# Altium schematic sheet P11 Hi3531A(SYSTEM)&RES.SchDoc
size 420 x 297 mm
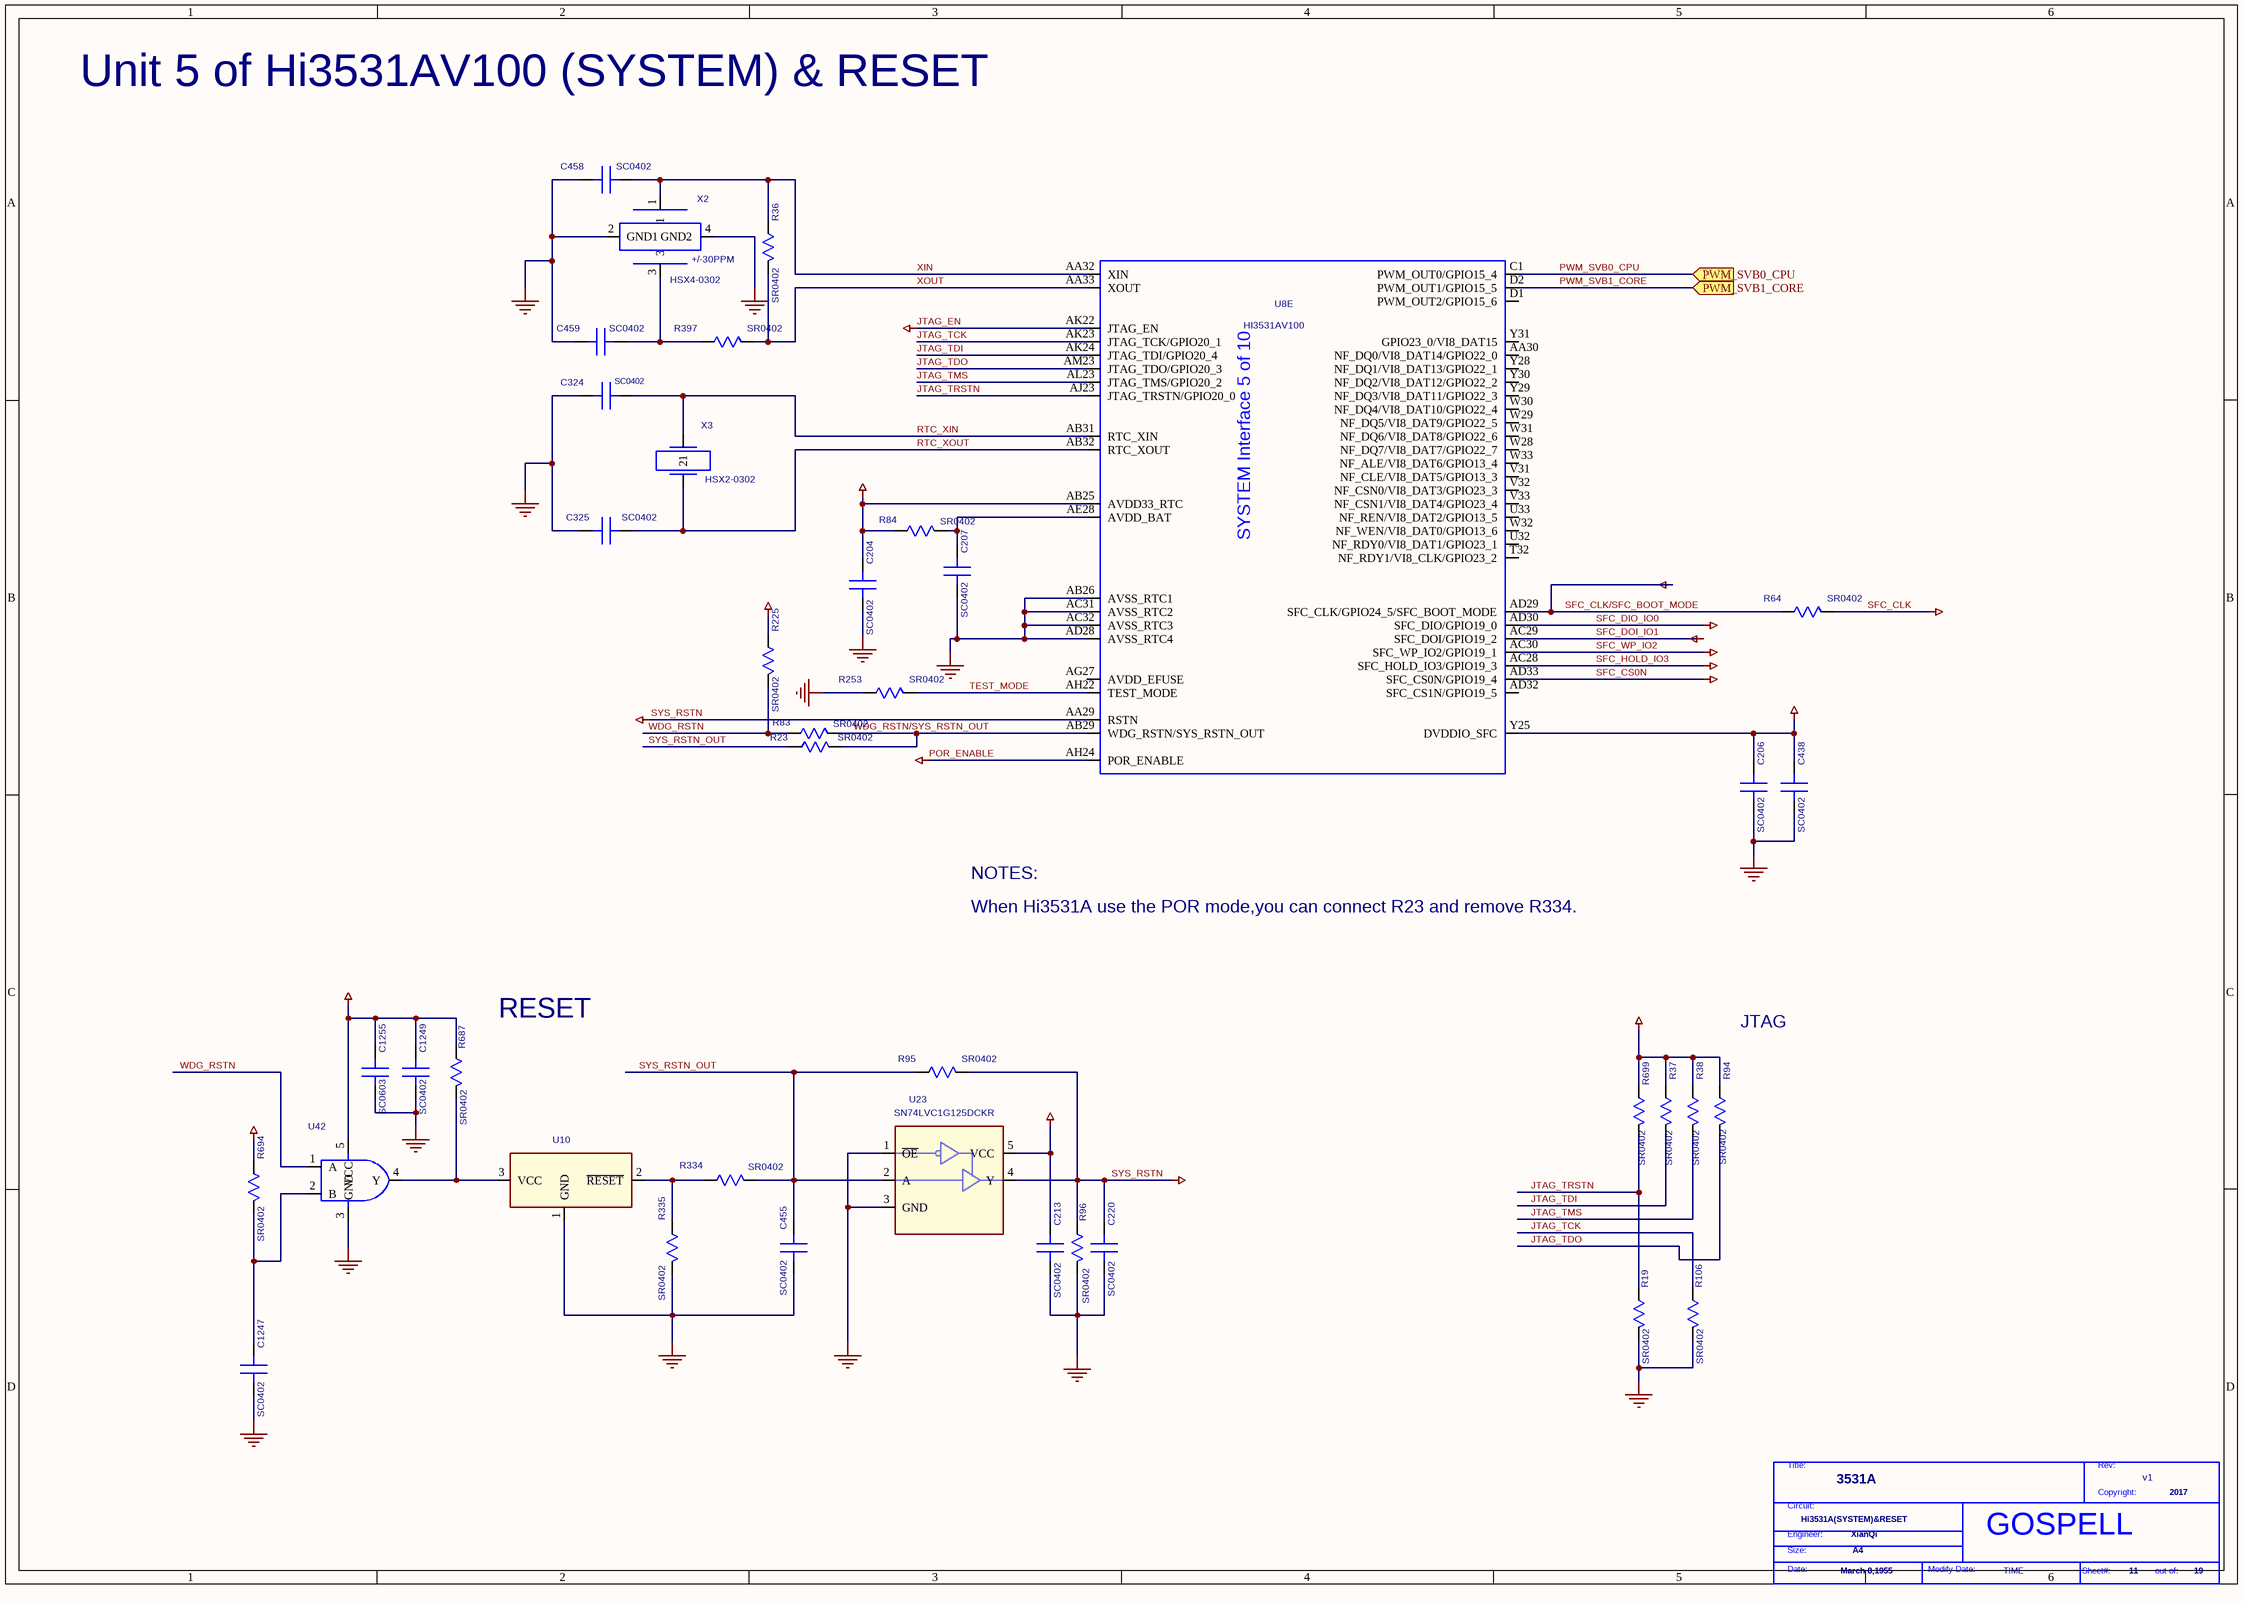
[diagram p0: P11 Hi3531A(SYSTEM)&RES.SchDoc]

## Parts
*  Page Modify Date: TIME  Engineer: XianQi  Copyright: 2017  Title: 3531A  RevCode: v1  Page Size: A4  Page Create Date: March 8,1955  Page Number: 11  Page Count: 19  Doc: Hi3531A(SYSTEM)&RESET  (hidden comment: GOSPELL)  (graphical)
C204  SC0402  [SC0402]
C206  SC0402  [SC0402]
C207  SC0402  [SC0402]
C213  SC0402  [SC0402]
C220  SC0402  [SC0402]
C324  SC0402  [SC0402]
C325  SC0402  [SC0402]
C438  SC0402  [SC0402]
C455  SC0402  [SC0402]
C458  SC0402  [SC0402]
C459  SC0402  [SC0402]
C1247  SC0402  [SC0402]
C1249  SC0402  [SC0402]
C1255  SC0603  [SC0603]
R19  SR0402  [SR0402]
R23  SR0402  [SR0402]
R36  SR0402  [SR0402]
R37  SR0402  [SR0402]
R38  SR0402  [SR0402]
R64  SR0402  [SR0402]
R83  SR0402  [SR0402]
R84  SR0402  [SR0402]
R94  SR0402  [SR0402]
R95  SR0402  [SR0402]
R96  SR0402  [SR0402]
R106  SR0402  [SR0402]
R225  SR0402  [SR0402]
R253  SR0402  [SR0402]
R334  SR0402  [SR0402]
R335  SR0402  [SR0402]
R397  SR0402  [SR0402]
R687  SR0402  [SR0402]
R694  SR0402  [SR0402]
R699  SR0402  [SR0402]
U8  DEVICE: HI3531AV100  [BGA805-32-3333]  (hidden comment: BGA805-32-3333)  (part E of 10)
U10  SOT23B  [SOT23B]  (value not drawn)
U23  DEVICE: SN74LVC1G125DCKR  [HSOT-SC70-DCK]  (hidden comment: HSOT-SC70-DCK)
U42  SOT23-5C  [SOT23-5C]  (value not drawn)
X2  HSX4-0302  [HSX4-0302]
X3  HSX2-0302  [HSX2-0302]

## Ports
PWM_SVB0_CPU (in), PWM_SVB1_CORE (in)

## Nets
3V3: C204.1(A) C206.1(A) C213.1(A) C438.1(A) C1249.1(A) C1255.1(A) R37.1(A) R38.1(A) R84.1(A) R94.1(A) R225.1(A) R687.1(A) R694.1(A) R699.1(A) U8.AB25(AVDD33_RTC) U8.Y25(DVDDIO_SFC) U23.5(VCC) U42.5(VCC)
GND: C204.2(B) C206.2(B) C207.2(B) C213.2(B) C220.2(B) C324.1(A) C325.1(A) C438.2(B) C455.2(B) C458.1(A) C459.1(A) C1247.2(B) C1249.2(B) C1255.2(B) R19.2(B) R96.2(B) R106.2(B) R253.1(A) R335.2(B) U8.AB26(AVSS_RTC1) U8.AC31(AVSS_RTC2) U8.AC32(AVSS_RTC3) U8.AD28(AVSS_RTC4) U10.1(GND) U23.1(~{OE}) U23.3(GND) U42.3(GND) X2.2(GND1) X2.4(GND2)
JTAG_EN: U8.AK22(JTAG_EN)
POR_ENABLE: U8.AH24(POR_ENABLE)
SFC_CLK: R64.2(B)
SFC_CLK/SFC_BOOT_MODE: R64.1(A) U8.AD29(SFC_CLK/GPIO24_5/SFC_BOOT_MODE)
SFC_CS0N: U8.AD33(SFC_CS0N/GPIO19_4)
SFC_DIO_IO0: U8.AD30(SFC_DIO/GPIO19_0)
SFC_DOI_IO1: U8.AC29(SFC_DOI/GPIO19_2)
SFC_HOLD_IO3: U8.AC28(SFC_HOLD_IO3/GPIO19_3)
SFC_WP_IO2: U8.AC30(SFC_WP_IO2/GPIO19_1)
SYS_RSTN: C220.1(A) R95.2(B) R96.1(A) U8.AA29(RSTN) U23.4(Y)
JTAG_TCK: R106.1(A) U8.AK23(JTAG_TCK/GPIO20_1)
JTAG_TDI: R37.2(B) U8.AK24(JTAG_TDI/GPIO20_4)
JTAG_TDO: R94.2(B) U8.AM23(JTAG_TDO/GPIO20_3)
JTAG_TMS: R38.2(B) U8.AL23(JTAG_TMS/GPIO20_2)
JTAG_TRSTN: R19.1(A) R699.2(B) U8.AJ23(JTAG_TRSTN/GPIO20_0)
PWM_SVB0_CPU: U8.C1(PWM_OUT0/GPIO15_4) ; port PWM_SVB0_CPU
PWM_SVB1_CORE: U8.D2(PWM_OUT1/GPIO15_5) ; port PWM_SVB1_CORE
RTC_XIN: C324.2(B) U8.AB31(RTC_XIN) X3.1
RTC_XOUT: C325.2(B) U8.AB32(RTC_XOUT) X3.2
SYS_RSTN_OUT: C455.1(A) R23.1(A) R95.1(A) R334.2(B) U23.2(A)
TEST_MODE: R253.2(B) U8.AH22(TEST_MODE)
WDG_RSTN: R83.1(A) R225.2(B) U42.1(A)
WDG_RSTN/SYS_RSTN_OUT: R23.2(B) R83.2(B) U8.AB29(WDG_RSTN/SYS_RSTN_OUT)
XIN: C458.2(B) R36.1(A) U8.AA32(XIN) X2.1
XOUT: R36.2(B) R397.2(B) U8.AA33(XOUT)
NetC207_1: C207.1(A) R84.2(B) U8.AE28(AVDD_BAT)
NetC459_2: C459.2(B) R397.1(A) X2.3
NetC1247_1: C1247.1(A) R694.2(B) U42.2(B)
NetR334_1: R334.1(A) R335.1(A) U10.2(~{RESET})
NetR687_2: R687.2(B) U10.3(VCC) U42.4(Y)

Not connected (* = marked no-connect by the designer): U8 AA30(NF_DQ0/VI8_DAT14/GPIO22_0) AD32(SFC_CS1N/GPIO19_5) AG27(AVDD_EFUSE) D1(PWM_OUT2/GPIO15_6) T32(NF_RDY1/VI8_CLK/GPIO23_2) U32(NF_RDY0/VI8_DAT1/GPIO23_1) U33(NF_REN/VI8_DAT2/GPIO13_5) V31(NF_CLE/VI8_DAT5/GPIO13_3) V32(NF_CSN0/VI8_DAT3/GPIO23_3) V33(NF_CSN1/VI8_DAT4/GPIO23_4) W28(NF_DQ7/VI8_DAT7/GPIO22_7) W29(NF_DQ5/VI8_DAT9/GPIO22_5) W30(NF_DQ4/VI8_DAT10/GPIO22_4) W31(NF_DQ6/VI8_DAT8/GPIO22_6) W32(NF_WEN/VI8_DAT0/GPIO13_6) W33(NF_ALE/VI8_DAT6/GPIO13_4) Y28(NF_DQ1/VI8_DAT13/GPIO22_1) Y29(NF_DQ3/VI8_DAT11/GPIO22_3) Y30(NF_DQ2/VI8_DAT12/GPIO22_2) Y31(GPIO23_0/VI8_DAT15)

## Notes on the sheet
- Unit 5 of Hi3531AV100 (SYSTEM) & RESET
- (near X2) +/-30PPM
- When Hi3531A use the POR mode,you can connect R23 and remove R334.
- NOTES:
- (near R687) RESET
- JTAG
- (in symbol GOSPELL) Title:; Rev:; Copyright:; Circuit:; Engineer:; Size:; Date:; Modify Date:; Sheet#:; out of:
- (in symbol HI3531AV100_M2_17, part E) SYSTEM Interface 5 of 10

## Library data of the parts
C204 C206 C207 C1247 = C_0_Dup2: PARTS: 1; PINSWAP: (A,B); LEVEL: STD; DEVICE: RMEMK105BJ104KV_FR; OriginalSymbolOrigin: (0,30); %208%%161%%192%%224%%195%%251%%179%%198%: SMD陶瓷电容; COMPONENT_HIGH_MAX: 0.55MM; %182%%238%%182%%168%%185%%164%%215%%247%%181%%231%%209%%185%(V): 16; %195%%232%%202%%246%: SMD陶瓷电容-16V-100NF-+/-10%-X7R-0402-BT; CODE: 8070614; PKG_TYPE: SC0402
C213 = C_0_Dup2: PARTS: 1; PINSWAP: (A,B); LEVEL: STD; DEVICE: RMEMK105BJ104KV_FR; OriginalSymbolOrigin: (0,30); CODE: 8070614; %195%%232%%202%%246%: SMD陶瓷电容-16V-100NF-+/-10%-X7R-0402-BT; %182%%238%%182%%168%%185%%164%%215%%247%%181%%231%%209%%185%(V): 16; COMPONENT_HIGH_MAX: 0.55MM; %208%%161%%192%%224%%195%%251%%179%%198%: SMD陶瓷电容; PKG_TYPE: SC0402
C220 C455 = C_0_Dup2: PARTS: 1; PINSWAP: (A,B); LEVEL: STD; DEVICE: 04025C102KAT2A; OriginalSymbolOrigin: (0,30); CODE: 8070531; %195%%232%%202%%246%: SMD陶瓷电容-50V-1NF-+/-10%-X7R-0402-BT; %182%%238%%182%%168%%185%%164%%215%%247%%181%%231%%209%%185%(V): 50; COMPONENT_HIGH_MAX: 0.56MM; %208%%161%%192%%224%%195%%251%%179%%198%: SMD陶瓷电容; PKG_TYPE: SC0402
C324 C325 = C_0_Dup2: PARTS: 1; PINSWAP: (A,B); LEVEL: STD; DEVICE: RMUMK105CG220JV_F; OriginalSymbolOrigin: (0,30); %208%%161%%192%%224%%195%%251%%179%%198%: SMD陶瓷电容; COMPONENT_HIGH_MAX: 0.55MM; %182%%238%%182%%168%%185%%164%%215%%247%%181%%231%%209%%185%(V): 50; %195%%232%%202%%246%: SMD陶瓷电容-50V-0.022NF-+/-5%-NP0-0402-BT; CODE: 8070545; PKG_TYPE: SC0402
C438 = C_0_Dup2: PARTS: 1; PINSWAP: (A,B); LEVEL: STD; DEVICE: C1005X5R0J475MTJ00F; OriginalSymbolOrigin: (0,30); %208%%161%%192%%224%%195%%251%%179%%198%: SMD陶瓷电容; COMPONENT_HIGH_MAX: 0.65MM; %182%%238%%182%%168%%185%%164%%215%%247%%181%%231%%209%%185%(V): 6.3; %195%%232%%202%%246%: SMD陶瓷电容-6.3V-4700NF-+/-20%-X5R-0402; CODE: 8071610; PKG_TYPE: SC0402
C458 C459 = C_0_Dup2: PARTS: 1; PINSWAP: (A,B); LEVEL: STD; DEVICE: C0402C150J5GAC_7867; OriginalSymbolOrigin: (0,30); CODE: 08070580; %195%%232%%202%%246%: SMD陶瓷电容-50V-0.015NF-+/-5%-NP0-0402; %182%%238%%182%%168%%185%%164%%215%%247%%181%%231%%209%%185%(V): 50; COMPONENT_HIGH_MAX: 0.55MM; %208%%161%%192%%224%%195%%251%%179%%198%: SMD陶瓷电容; PKG_TYPE: SC0402
C1249 = C_0_Dup2: PARTS: 1; PINSWAP: (A,B); LEVEL: STD; DEVICE: C0402C104K8PAC_7867; OriginalSymbolOrigin: (0,30); CODE: 8070561; %195%%232%%202%%246%: SMD陶瓷电容-10V-100NF-+/-10%-X5R-0402; %182%%238%%182%%168%%185%%164%%215%%247%%181%%231%%209%%185%(V): 10; COMPONENT_HIGH_MAX: 0.55MM; %208%%161%%192%%224%%195%%251%%179%%198%: SMD陶瓷电容; ALT_SYMBOLS: (T:SC0402;B:SC0402,SC0402-BGA,SC0402-BGA-A); TECHNIC: 回流回流; PKG_TYPE: SC0402
C1255 = C_0_Dup2: PARTS: 1; PINSWAP: (A,B); LEVEL: STD; DEVICE: C1608X5R0J106MT0A0E_A; OriginalSymbolOrigin: (0,30); %208%%161%%192%%224%%195%%251%%179%%198%: SMD陶瓷电容; COMPONENT_HIGH_MAX: 0.9MM; %182%%238%%182%%168%%185%%164%%215%%247%%181%%231%%209%%185%(V): 6.3; %195%%232%%202%%246%: SMD陶瓷电容-6.3V-10000NF-+/-20%-X5R-0603; CODE: 8070821; PKG_TYPE: SC0603
R19 = R_2: PARTS: 1; OriginalSymbolOrigin: (10,20); PINSWAP: (A,B); DEVICE: RK73H1ETTP1002F; LEVEL: STD; %208%%161%%192%%224%%195%%251%%179%%198%: 片式厚膜电阻器; COMPONENT_HIGH_MAX: 0.4MM; %215%%232%%214%%181%%212%%202%%208%%237%%198%%171%%178%%238%: +/-1%; %182%%238%%182%%168%%185%%166%%194%%202%(W): 0.06; %195%%232%%202%%246%: 片式厚膜电阻器-0.0625W-10000OHM-+/-1%-0402-BT; CODE: 7090867; PKG_TYPE: SR0402
R23 R95 = R_1: PARTS: 1; LEVEL: STD; DEVICE: RC0402JR_070R; PINSWAP: (A,B); OriginalSymbolOrigin: (10,20); CODE: 7090800; %195%%232%%202%%246%: 片式厚膜电阻器-0.0625W-0OHM-< 50MOHM-0402-1A-BT; %182%%238%%182%%168%%185%%166%%194%%202%(W): 0.06; %215%%232%%214%%181%%212%%202%%208%%237%%198%%171%%178%%238%: < 50MOHM; COMPONENT_HIGH_MAX: 0.4MM; %208%%161%%192%%224%%195%%251%%179%%198%: 片式厚膜电阻器; PKG_TYPE: SR0402
R36 = R_1: PARTS: 1; LEVEL: STD; DEVICE: RK73H1ETTP1004F; PINSWAP: (A,B); OriginalSymbolOrigin: (10,20); %208%%161%%192%%224%%195%%251%%179%%198%: 片式厚膜电阻器; COMPONENT_HIGH_MAX: 0.4MM; %215%%232%%214%%181%%212%%202%%208%%237%%198%%171%%178%%238%: ±1%; %182%%238%%182%%168%%185%%166%%194%%202%(W): 0.06; %195%%232%%202%%246%: 片式厚膜电阻器-0.0625W-1000000OHM-±1%-0402; CODE: 7090857; PKG_TYPE: SR0402
R37 = R_2: PARTS: 1; OriginalSymbolOrigin: (10,20); PINSWAP: (A,B); DEVICE: RK73B1ELTP472J; LEVEL: STD; %208%%161%%192%%224%%195%%251%%179%%198%: 片式厚膜电阻器; COMPONENT_HIGH_MAX: 0.4MM; %215%%232%%214%%181%%212%%202%%208%%237%%198%%171%%178%%238%: +/-5%; %182%%238%%182%%168%%185%%166%%194%%202%(W): 0.06; %195%%232%%202%%246%: 片式厚膜电阻器-0.0625W-4700OHM-+/-5%-0402-BT; CODE: 7090793; PKG_TYPE: SR0402
R38 R94 R699 = R_2: PARTS: 1; OriginalSymbolOrigin: (10,20); PINSWAP: (A,B); DEVICE: RK73B1ELTP472J; LEVEL: STD; CODE: 7090793; %195%%232%%202%%246%: 片式厚膜电阻器-0.0625W-4700OHM-+/-5%-0402-BT; %182%%238%%182%%168%%185%%166%%194%%202%(W): 0.06; %215%%232%%214%%181%%212%%202%%208%%237%%198%%171%%178%%238%: +/-5%; COMPONENT_HIGH_MAX: 0.4MM; %208%%161%%192%%224%%195%%251%%179%%198%: 片式厚膜电阻器; PKG_TYPE: SR0402
R64 = R_1: PARTS: 1; LEVEL: STD; DEVICE: RC0402FR_0733RL; PINSWAP: (A,B); OriginalSymbolOrigin: (10,20); CODE: 7090836; %195%%232%%202%%246%: 片式厚膜电阻器-0.0625W-33OHM-+/-1%-0402; %182%%238%%182%%168%%185%%166%%194%%202%(W): 0.06; %215%%232%%214%%181%%212%%202%%208%%237%%198%%171%%178%%238%: +/-1%; COMPONENT_HIGH_MAX: 0.4MM; %208%%161%%192%%224%%195%%251%%179%%198%: 片式厚膜电阻器; PKG_TYPE: SR0402
R83 R84 = R_1: PARTS: 1; LEVEL: STD; DEVICE: RC0402JR_070R; PINSWAP: (A,B); OriginalSymbolOrigin: (10,20); %208%%161%%192%%224%%195%%251%%179%%198%: 片式厚膜电阻器; COMPONENT_HIGH_MAX: 0.4MM; %215%%232%%214%%181%%212%%202%%208%%237%%198%%171%%178%%238%: < 50MOHM; %182%%238%%182%%168%%185%%166%%194%%202%(W): 0.06; %195%%232%%202%%246%: 片式厚膜电阻器-0.0625W-0OHM-< 50MOHM-0402-1A-BT; CODE: 7090800; PKG_TYPE: SR0402
R96 = R_1: PARTS: 1; LEVEL: STD; DEVICE: RC0402FR_071KL; PINSWAP: (A,B); OriginalSymbolOrigin: (10,20); %208%%161%%192%%224%%195%%251%%179%%198%: 片式厚膜电阻器; COMPONENT_HIGH_MAX: 0.4MM; %215%%232%%214%%181%%212%%202%%208%%237%%198%%171%%178%%238%: +/-1%; %182%%238%%182%%168%%185%%166%%194%%202%(W): 0.06; %195%%232%%202%%246%: 片式厚膜电阻器-0.0625W-1000OHM-+/-1%-0402-BT; CODE: 7091282; PKG_TYPE: SR0402
R106 = R_2: PARTS: 1; OriginalSymbolOrigin: (10,20); PINSWAP: (A,B); DEVICE: RC0402FR_071KL; LEVEL: STD; CODE: 7091282; %195%%232%%202%%246%: 片式厚膜电阻器-0.0625W-1000OHM-+/-1%-0402-BT; %182%%238%%182%%168%%185%%166%%194%%202%(W): 0.06; %215%%232%%214%%181%%212%%202%%208%%237%%198%%171%%178%%238%: +/-1%; COMPONENT_HIGH_MAX: 0.4MM; %208%%161%%192%%224%%195%%251%%179%%198%: 片式厚膜电阻器; PKG_TYPE: SR0402
R225 = R_1: PARTS: 1; LEVEL: STD; DEVICE: RK73B1ELTP472J; PINSWAP: (A,B); OriginalSymbolOrigin: (10,20); CODE: 7090793; %195%%232%%202%%246%: 片式厚膜电阻器-0.0625W-4700OHM-+/-5%-0402-BT; %182%%238%%182%%168%%185%%166%%194%%202%(W): 0.06; %215%%232%%214%%181%%212%%202%%208%%237%%198%%171%%178%%238%: +/-5%; COMPONENT_HIGH_MAX: 0.4MM; %208%%161%%192%%224%%195%%251%%179%%198%: 片式厚膜电阻器; PKG_TYPE: SR0402
R253 = R_1: PARTS: 1; LEVEL: STD; DEVICE: RK73B1ELTP472J; PINSWAP: (A,B); OriginalSymbolOrigin: (10,20); %208%%161%%192%%224%%195%%251%%179%%198%: 片式厚膜电阻器; COMPONENT_HIGH_MAX: 0.4MM; %215%%232%%214%%181%%212%%202%%208%%237%%198%%171%%178%%238%: +/-5%; %182%%238%%182%%168%%185%%166%%194%%202%(W): 0.06; %195%%232%%202%%246%: 片式厚膜电阻器-0.0625W-4700OHM-+/-5%-0402-BT; CODE: 7090793; PKG_TYPE: SR0402
R334 = R_1: PARTS: 1; LEVEL: STD; DEVICE: RC0402JR_07100R; PINSWAP: (A,B); OriginalSymbolOrigin: (10,20); %208%%161%%192%%224%%195%%251%%179%%198%: 片式厚膜电阻器; COMPONENT_HIGH_MAX: 0.4MM; %215%%232%%214%%181%%212%%202%%208%%237%%198%%171%%178%%238%: +/-5%; %182%%238%%182%%168%%185%%166%%194%%202%(W): 0.06; %195%%232%%202%%246%: 片式厚膜电阻器-0.0625W-100OHM-+/-5%-0402-BT; CODE: 7090807; PKG_TYPE: SR0402
R335 = R_1: PARTS: 1; LEVEL: STD; DEVICE: RK73H1ETTP1003F; PINSWAP: (A,B); OriginalSymbolOrigin: (10,20); %208%%161%%192%%224%%195%%251%%179%%198%: 片式厚膜电阻器; COMPONENT_HIGH_MAX: 0.4MM; %215%%232%%214%%181%%212%%202%%208%%237%%198%%171%%178%%238%: +/-1%; %182%%238%%182%%168%%185%%166%%194%%202%(W): 0.06; %195%%232%%202%%246%: 片式厚膜电阻器-0.0625W-100000OHM-+/-1%-0402; CODE: 7090875; PKG_TYPE: SR0402
R397 = R_1: PARTS: 1; LEVEL: STD; DEVICE: RC_02W100FT; PINSWAP: (A,B); OriginalSymbolOrigin: (10,20); %208%%161%%192%%224%%195%%251%%179%%198%: 片式厚膜电阻器; COMPONENT_HIGH_MAX: 0.4MM; %215%%232%%214%%181%%212%%202%%208%%237%%198%%171%%178%%238%: +/-1%; %182%%238%%182%%168%%185%%166%%194%%202%(W): 0.06; %195%%232%%202%%246%: 片式厚膜电阻器-0.0625W-10OHM-+/-1%-0402; CODE: 7091305; PKG_TYPE: SR0402
R687 = R_1: PARTS: 1; LEVEL: STD; DEVICE: RC0402JR_071KL; PINSWAP: (A,B); OriginalSymbolOrigin: (10,20); CODE: 7090809; %195%%232%%202%%246%: 片式厚膜电阻器-0.0625W-1000OHM-+/-5%-0402-BT; %182%%238%%182%%168%%185%%166%%194%%202%(W): 0.06; %215%%232%%214%%181%%212%%202%%208%%237%%198%%171%%178%%238%: +/-5%; %208%%161%%192%%224%%195%%251%%179%%198%: 片式厚膜电阻器; PKG_TYPE: SR0402
R694 = R_1: PARTS: 1; LEVEL: STD; DEVICE: RK73B1ELTP472J; PINSWAP: (A,B); OriginalSymbolOrigin: (10,20); %208%%161%%192%%224%%195%%251%%179%%198%: 片式厚膜电阻器; COMPONENT_HIGH_MAX: 0.4MM; %215%%232%%214%%181%%212%%202%%208%%237%%198%%171%%178%%238%: ±5％; %182%%238%%182%%168%%185%%166%%194%%202%(W): 0.06; %195%%232%%202%%246%: 片式厚膜电阻器-0.0625W-4700OHM-+/-5%-0402-BT; CODE: 7090793; PKG_TYPE: SR0402
U8 = HI3531AV100_M2_17: FORWARD_PCB: 1; HETERO: (HI3531AV100_DDR1),(HI3531AV100_DDR2),(HI3531AV100_SYSTEM),(HI3531AV100_AD),(HI3531AV100_VO),(HI3531AV100_M1),(HI3531AV100_M2),(HI3531AV100_POWER),(HI3531AV100_VSS1),(HI3531AV100_VSS2); LEVEL: STD; OriginalSymbolOrigin: (30,630); CaptureCellPackProp: HI3531AV100_M2E; CODE: 35020607; PARTS: 1; PKG_TYPE: BGA805-32-3333
U10 = ADM809_0: PARTS: 1; DEVICE: PT7M7809RTE; LEVEL: STD; CODE: 39070039; OriginalSymbolOrigin: (10,60); COMPONENT_HIGH_MAX: 1.45MM; %195%%232%%202%%246%: POWER MANAGEMENT IC-3.3V-电压监测-2.63VTH-PUSH-PULL OUTPUT-SOT23-终端专用; PKG_TYPE: SOT23B
U23 = SN74LVC1G125Q-Q1_1: PARTS: 1; LEVEL: STD; CODE: 36020340; OriginalSymbolOrigin: (10,90); %195%%232%%202%%246%: CMOS-单门三态缓冲器-SOT23-6.9NS-24MA-LVTTL-LVTTL; %208%%161%%192%%224%%195%%251%%179%%198%: CMOS; SIGNAL_MODEL: 74LVC1G125DBVR_SOT5; PKG_TYPE: HSOT-SC70-DCK
U42 = NC7SZ08P5X_0: PARTS: 1; DEVICE: NC7SV08P5X; LEVEL: STD; CODE: 36020363; OriginalSymbolOrigin: (20,50); %195%%232%%202%%246%: CMOS-SINGLE 2-INPUT POSITIVE-AND GATE-SC-70-2.4NS-16MA-CMOS-CMOS-终端专用; COMPONENT_HIGH_MAX: 1.1MM; PKG_TYPE: SOT23-5C
X2 = X_B_7: PARTS: 1; CODE: 12020151; DEVICE: NX3225SA24MHZ; LEVEL: STD; OriginalSymbolOrigin: (20,80); COMPONENT_HIGH_MAX: 0.75MM; %195%%232%%202%%246%: 晶体谐振器-24MHZ-12PF-±30PPM-50OHM-HCX-3SB-终端专用; PKG_TYPE: HSX4-0302
X3 = X_1: PARTS: 1; CODE: 12020212; DEVICE: 9H03200019; LEVEL: STD; OriginalSymbolOrigin: (10,40); %195%%232%%202%%246%: 晶体谐振器-0.032768MHZ-12.5PF-+/-20PPM-70000OHM-SMD3.2*1.5; COMPONENT_HIGH_MAX: 0.85MM; %208%%161%%192%%224%%195%%251%%179%%198%: 晶体谐振器; PKG_TYPE: HSX2-0302